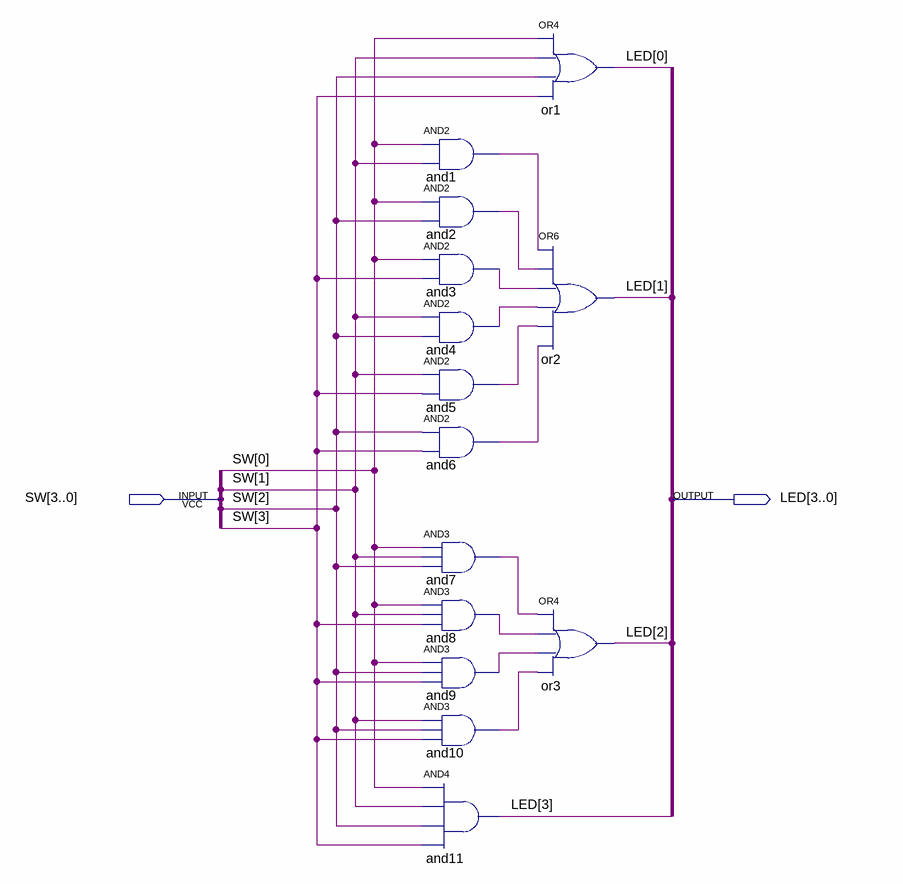
[diagram p0: schematic sheet]
// Quartus schematic SALIDA_LED.bdf as structural Verilog: 14 symbols, 2 pins
module SALIDA_LED (
  input  [3:0] SW,
  output [3:0] LED
);

  wire and1_out, and2_out, and3_out, and4_out, and5_out, and6_out, and7_out, and8_out, and9_out, and10_out;

  and and1 (and1_out, SW[0], SW[1]);
  and and2 (and2_out, SW[0], SW[2]);
  and and3 (and3_out, SW[0], SW[3]);
  and and4 (and4_out, SW[1], SW[2]);
  and and5 (and5_out, SW[1], SW[3]);
  and and6 (and6_out, SW[2], SW[3]);
  and and7 (and7_out, SW[0], SW[1], SW[2]);
  and and8 (and8_out, SW[0], SW[1], SW[3]);
  and and9 (and9_out, SW[0], SW[2], SW[3]);
  and and10 (and10_out, SW[1], SW[2], SW[3]);
  and and11 (LED[3], SW[0], SW[1], SW[2], SW[3]);
  or or1 (LED[0], SW[0], SW[1], SW[2], SW[3]);
  or or2 (LED[1], and1_out, and2_out, and3_out, and4_out, and5_out, and6_out);
  or or3 (LED[2], and7_out, and8_out, and9_out, and10_out);
endmodule
